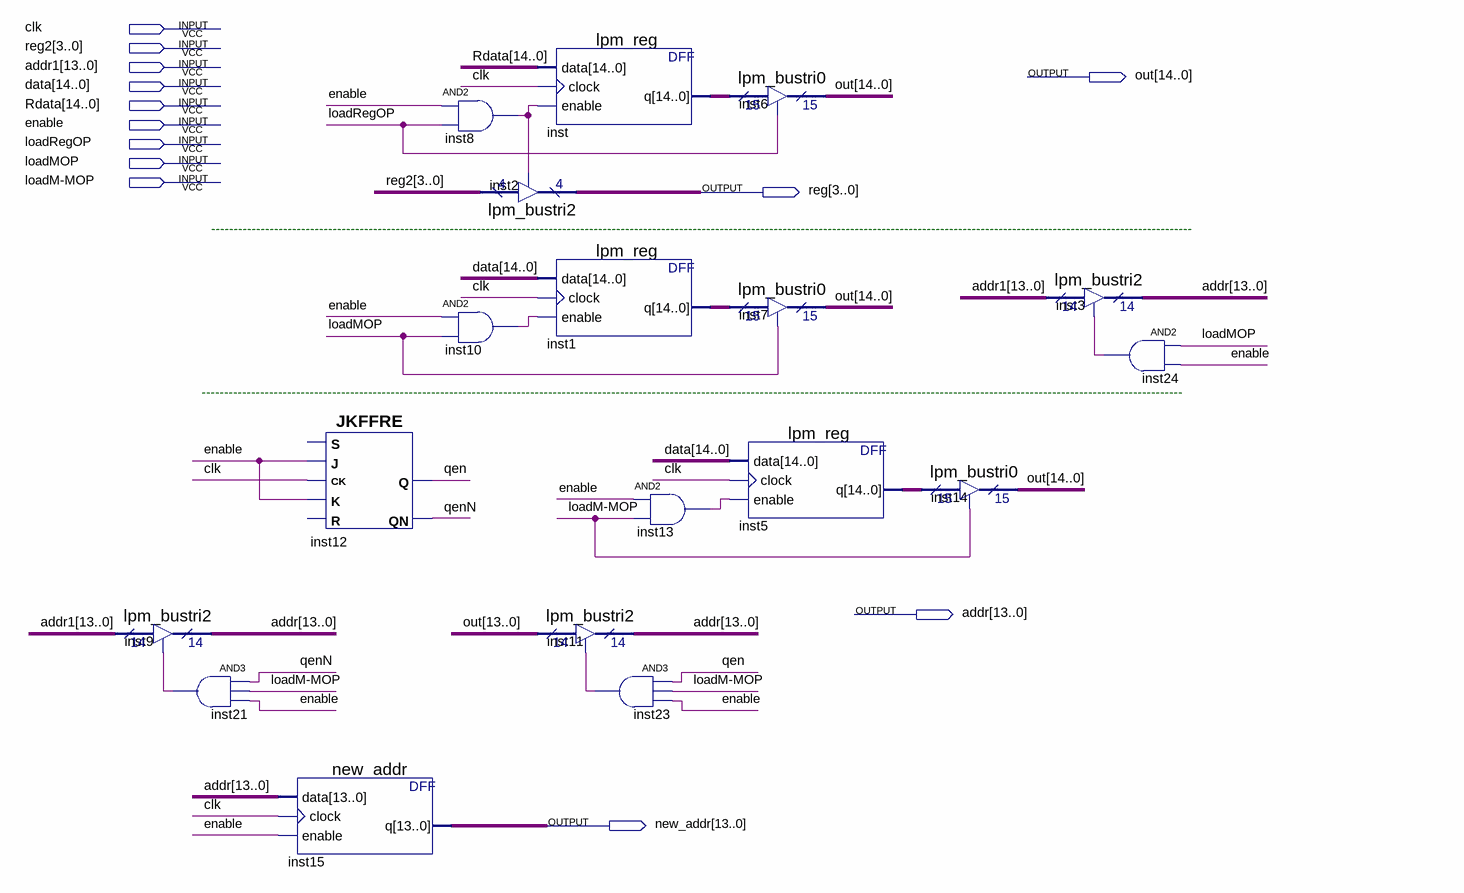
[diagram p0: schematic sheet]
// Quartus schematic loadOP2.bdf as structural Verilog: 18 symbols, 13 pins
module loadOP2 (
  input  clk,
  input  [3:0] reg2,
  input  [13:0] addr1,
  input  [14:0] data,
  input  [14:0] Rdata,
  input  enable,
  input  loadRegOP,
  input  loadMOP,
  input  \loadM-MOP ,
  output [14:0] out,
  output [3:0] \reg ,
  output [13:0] addr,
  output [13:0] new_addr
);

  wire inst8_out, inst10_out, inst13_out, inst21_out, inst23_out, inst24_out, qen, qenN;
  wire [14:0] inst1_q, inst5_q, inst_q;

  lpm_bustri2 inst9 (.enabledt(inst21_out), .data(addr1), .tridata(addr));
  and inst21 (inst21_out, qenN, \loadM-MOP , enable);
  new_addr inst15 (.data(addr), .clock(clk), .enable(enable), .q(new_addr));
  JKFFRE inst12 (.K(enable), .CK(clk), .J(enable), .QN(qenN), .Q(qen));  // open: R, S
  and inst8 (inst8_out, enable, loadRegOP);
  and inst10 (inst10_out, enable, loadMOP);
  lpm_bustri2 inst2 (.enabledt(inst8_out), .data(reg2), .tridata(\reg ));
  lpm_reg inst (.data(Rdata), .clock(clk), .enable(inst8_out), .q(inst_q));
  lpm_reg inst1 (.data(data), .clock(clk), .enable(inst10_out), .q(inst1_q));
  lpm_bustri2 inst11 (.enabledt(inst23_out), .data(out[13:0]), .tridata(addr));
  and inst23 (inst23_out, qen, \loadM-MOP , enable);
  and inst13 (inst13_out, enable, \loadM-MOP );
  lpm_bustri0 inst6 (.enabledt(loadRegOP), .data(inst_q), .tridata(out));
  lpm_bustri0 inst7 (.enabledt(loadMOP), .data(inst1_q), .tridata(out));
  lpm_reg inst5 (.data(data), .clock(clk), .enable(inst13_out), .q(inst5_q));
  lpm_bustri0 inst14 (.enabledt(\loadM-MOP ), .data(inst5_q), .tridata(out));
  lpm_bustri2 inst3 (.enabledt(inst24_out), .data(addr1), .tridata(addr));
  and inst24 (inst24_out, loadMOP, enable);

  // Notes on the sheet:
  //   --------------------------------------------------------------------------------------------------------------------------------------------------------------------------------------------------------------------------
  //   --------------------------------------------------------------------------------------------------------------------------------------------------------------------------------------------------------------------------
endmodule
